# Altium schematic sheet temp_packages.SchDoc
size D
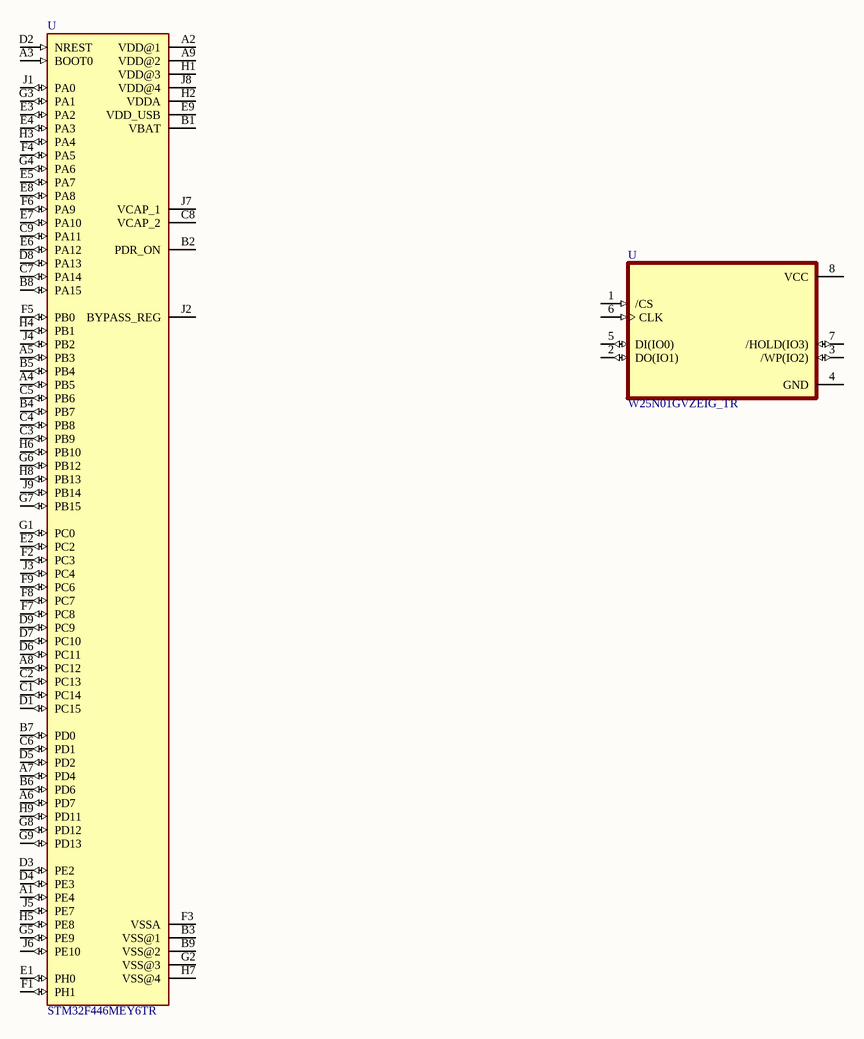
[diagram p0: temp_packages.SchDoc]

## Parts
(Parts that share a designator on the sheet are numbered #1, #2 ... from top to bottom, then left to right.)
U#1  W25N01GVZEIG_TR  [SON95P300X300X100-7N]
U#2  STM32F446MEY6TR  [BGA81C40P9X9_368X383X60]

## Nets

Not connected (* = marked no-connect by the designer): U#1 1(/CS) 2(DO(IO1)) 3(/WP(IO2)) 4(GND) 5(DI(IO0)) 6(CLK) 7(/HOLD(IO3)) 8(VCC); U#2 A1(PE4) A2(VDD@1) A3(BOOT0) A4(PB5) A5(PB3) A6(PD7) A7(PD4) A8(PC12) A9(VDD@2) B1(VBAT) B2(PDR_ON) B3(VSS@1) B4(PB7) B5(PB4) B6(PD6) B7(PD0) B8(PA15) B9(VSS@2) C1(PC14) C2(PC13) C3(PB9) C4(PB8) C5(PB6) C6(PD1) C7(PA14) C8(VCAP_2) C9(PA11) D1(PC15) D2(NREST) D3(PE2) D4(PE3) D5(PD2) D6(PC11) D7(PC10) D8(PA13) D9(PC9) E1(PH0) E2(PC2) E3(PA2) E4(PA3) E5(PA7) E6(PA12) E7(PA10) E8(PA8) E9(VDD_USB) F1(PH1) F2(PC3) F3(VSSA) F4(PA5) F5(PB0) F6(PA9) F7(PC8) F8(PC7) F9(PC6) G1(PC0) G2(VSS@3) G3(PA1) G4(PA6) G5(PE9) G6(PB12) G7(PB15) G8(PD12) G9(PD13) H1(VDD@3) H2(VDDA) H3(PA4) H4(PB1) H5(PE8) H6(PB10) H7(VSS@4) H8(PB13) H9(PD11) J1(PA0) J2(BYPASS_REG) J3(PC4) J4(PB2) J5(PE7) J6(PE10) J7(VCAP_1) J8(VDD@4) J9(PB14)

## Notes on the sheet
- Title
- Size:
- Date:
- File:
- D
- Number:
- Time:
- Revision:
- Sheet
- of
- Author: Edward Lai
- Email: edward@vibe.us
- Vibe Inc
- Hangzhou
- vibe.us <http://vibe.us>

## Library data of the parts
U#1 = W25N01GVZEIG_TR: FLASH - NAND Memory IC 1Gb _128M x 8_ SPI 104MHz 8-WSON _8x6_; MP: W25N01GVZEIG TR; MF: Winbond Electronics; Price: None; Package: WSON-8 Winbond; Value: *; Availability: Unavailable; SnapEDA_Link: https://www.snapeda.com/parts/W25N01GVZEIG%20TR/Winbond%20Electronics/view-part/1101444/?ref=snap
U#2 = STM32F446MEY6TR: ARMÂ® CortexÂ®-M4 STM32F4 Microcontroller IC 32-Bit 180MHz 512KB _512K x 8_ FLASH 81-WLCSP _3.80x3.69_; MF: STMicroelectronics; Package: WLCSP-81 STMicroelectronics; MP: STM32F446MEY6TR; SnapEDA_Link: https://www.snapeda.com/parts/STM32F446MEY6TR/STMicroelectronics/view-part/378075/?ref=snap; Price: None; Value: *; Availability: Unavailable